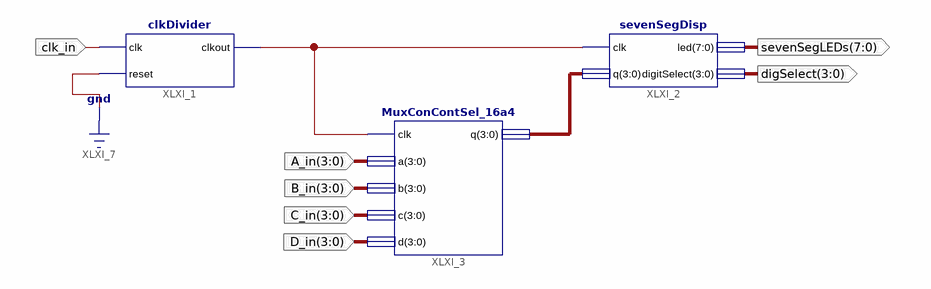
[diagram p0: schematic sheet 1]
// Xilinx ISE schematic VisDyn.sch (spartan3e) as structural Verilog: 3 symbols, 7 ports
module VisDyn (
  input  [3:0] A_in,
  input  [3:0] B_in,
  input  [3:0] C_in,
  input  [3:0] D_in,
  input  clk_in,
  output [7:0] sevenSegLEDs,
  output [3:0] digSelect
);

  wire XLXN_12;
  wire [3:0] XLXN_2;

  clkDivider XLXI_1 (.clk(clk_in), .reset(1'b0), .clkout(XLXN_12));
  sevenSegDisp XLXI_2 (.clk(XLXN_12), .q(XLXN_2), .led(sevenSegLEDs), .digitSelect(digSelect));
  MuxConContSel_16a4 XLXI_3 (.clk(XLXN_12), .a(A_in), .b(B_in), .c(C_in), .d(D_in), .q(XLXN_2));
endmodule
